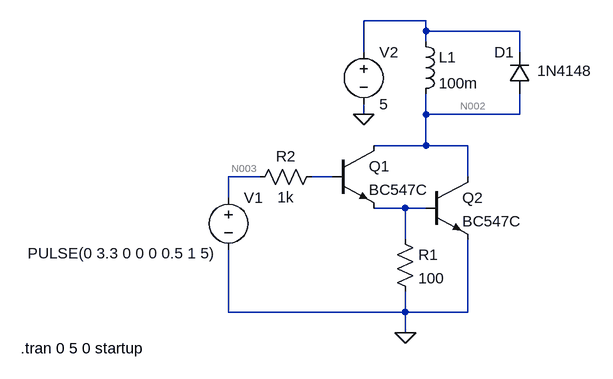
[diagram p0: schematic G5LE-relay-coil-driver-circuitry.asc]
G5LE-relay-coil-driver-circuitry.asc, the LTspice schematic file:
Version 4
SHEET 1 880 680
WIRE 208 -128 112 -128
WIRE 208 -112 208 -128
WIRE 352 -112 208 -112
WIRE 208 -96 208 -112
WIRE 112 -80 112 -128
WIRE 352 -80 352 -112
WIRE 112 16 112 0
WIRE 208 16 208 -16
WIRE 352 16 352 -16
WIRE 352 16 208 16
WIRE 208 64 208 16
WIRE 208 64 128 64
WIRE 272 64 208 64
WIRE -48 112 -96 112
WIRE 64 112 32 112
WIRE 272 112 272 64
WIRE -96 144 -96 112
WIRE 176 160 128 160
WIRE 208 160 176 160
WIRE 176 208 176 160
WIRE -96 320 -96 224
WIRE 176 320 176 288
WIRE 176 320 -96 320
WIRE 272 320 272 208
WIRE 272 320 176 320
WIRE 176 352 176 320
FLAG 176 352 0
FLAG 112 16 0
SYMBOL npn 64 64 R0
SYMATTR InstName Q1
SYMATTR Value BC547C
SYMBOL npn 208 112 R0
SYMATTR InstName Q2
SYMATTR Value BC547C
SYMBOL res 160 192 R0
SYMATTR InstName R1
SYMATTR Value 100
SYMBOL res 48 96 R90
WINDOW 0 0 56 VBottom 2
WINDOW 3 32 56 VTop 2
SYMATTR InstName R2
SYMATTR Value 1k
SYMBOL ind 192 -112 R0
SYMATTR InstName L1
SYMATTR Value 100m
SYMATTR SpiceLine Ipk=79.4m Rser=63
SYMBOL voltage 112 -96 R0
WINDOW 123 0 0 Left 0
WINDOW 39 0 0 Left 0
SYMATTR InstName V2
SYMATTR Value 5
SYMBOL voltage -96 128 R0
WINDOW 3 -164 86 Top 2
WINDOW 123 0 0 Left 0
WINDOW 39 0 0 Left 0
SYMATTR Value PULSE(0 3.3 0 0 0 0.5 1 5)
SYMATTR InstName V1
SYMBOL diode 368 -16 R180
WINDOW 0 24 64 Left 2
WINDOW 3 -96 35 Left 2
SYMATTR InstName D1
SYMATTR Value 1N4148
TEXT -416 376 Left 2 !.tran 0 5 0 startup

The netlist it stands for:
* G5LE-relay-coil-driver-circuitry.asc
Q1 N002 N004 N005 0 BC547C
Q2 N002 N005 0 0 BC547C
R1 N005 0 100
R2 N004 N003 1k
L1 N001 N002 100m Ipk=79.4m Rser=63
V2 N001 0 5
V1 N003 0 PULSE(0 3.3 0 0 0 0.5 1 5)
D1 N002 N001 1N4148
.model D D
.lib standard.dio
.model NPN NPN
.model PNP PNP
.lib standard.bjt
.tran 0 5 0 startup
.backanno
.end

* Results of the author's LTspice run, read from the files saved beside the schematic
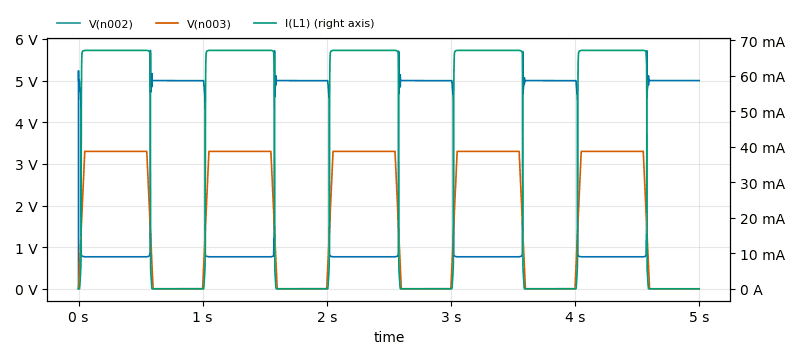
[diagram p1: Transient Analysis of G5LE-relay-coil-driver-circuitry.asc, plotted from the saved traces]
* Transient Analysis, 1 run:
*   V(n002): min 0 V, max 5.725 V, average 2.64 V, rms 3.371 V, last 5 V
*   V(n003): min 0 V, max 3.3 V, average 1.815 V, rms 2.411 V, last 0 V
*   I(L1): min -1.832 µA, max 67.17 mA, average 37.47 mA, rms 50.05 mA, last 0 A